# EAGLE design rev_beta_03_1H_smd_ab4 (EAGLE 7.3.0)

## Sheet 1 of 2
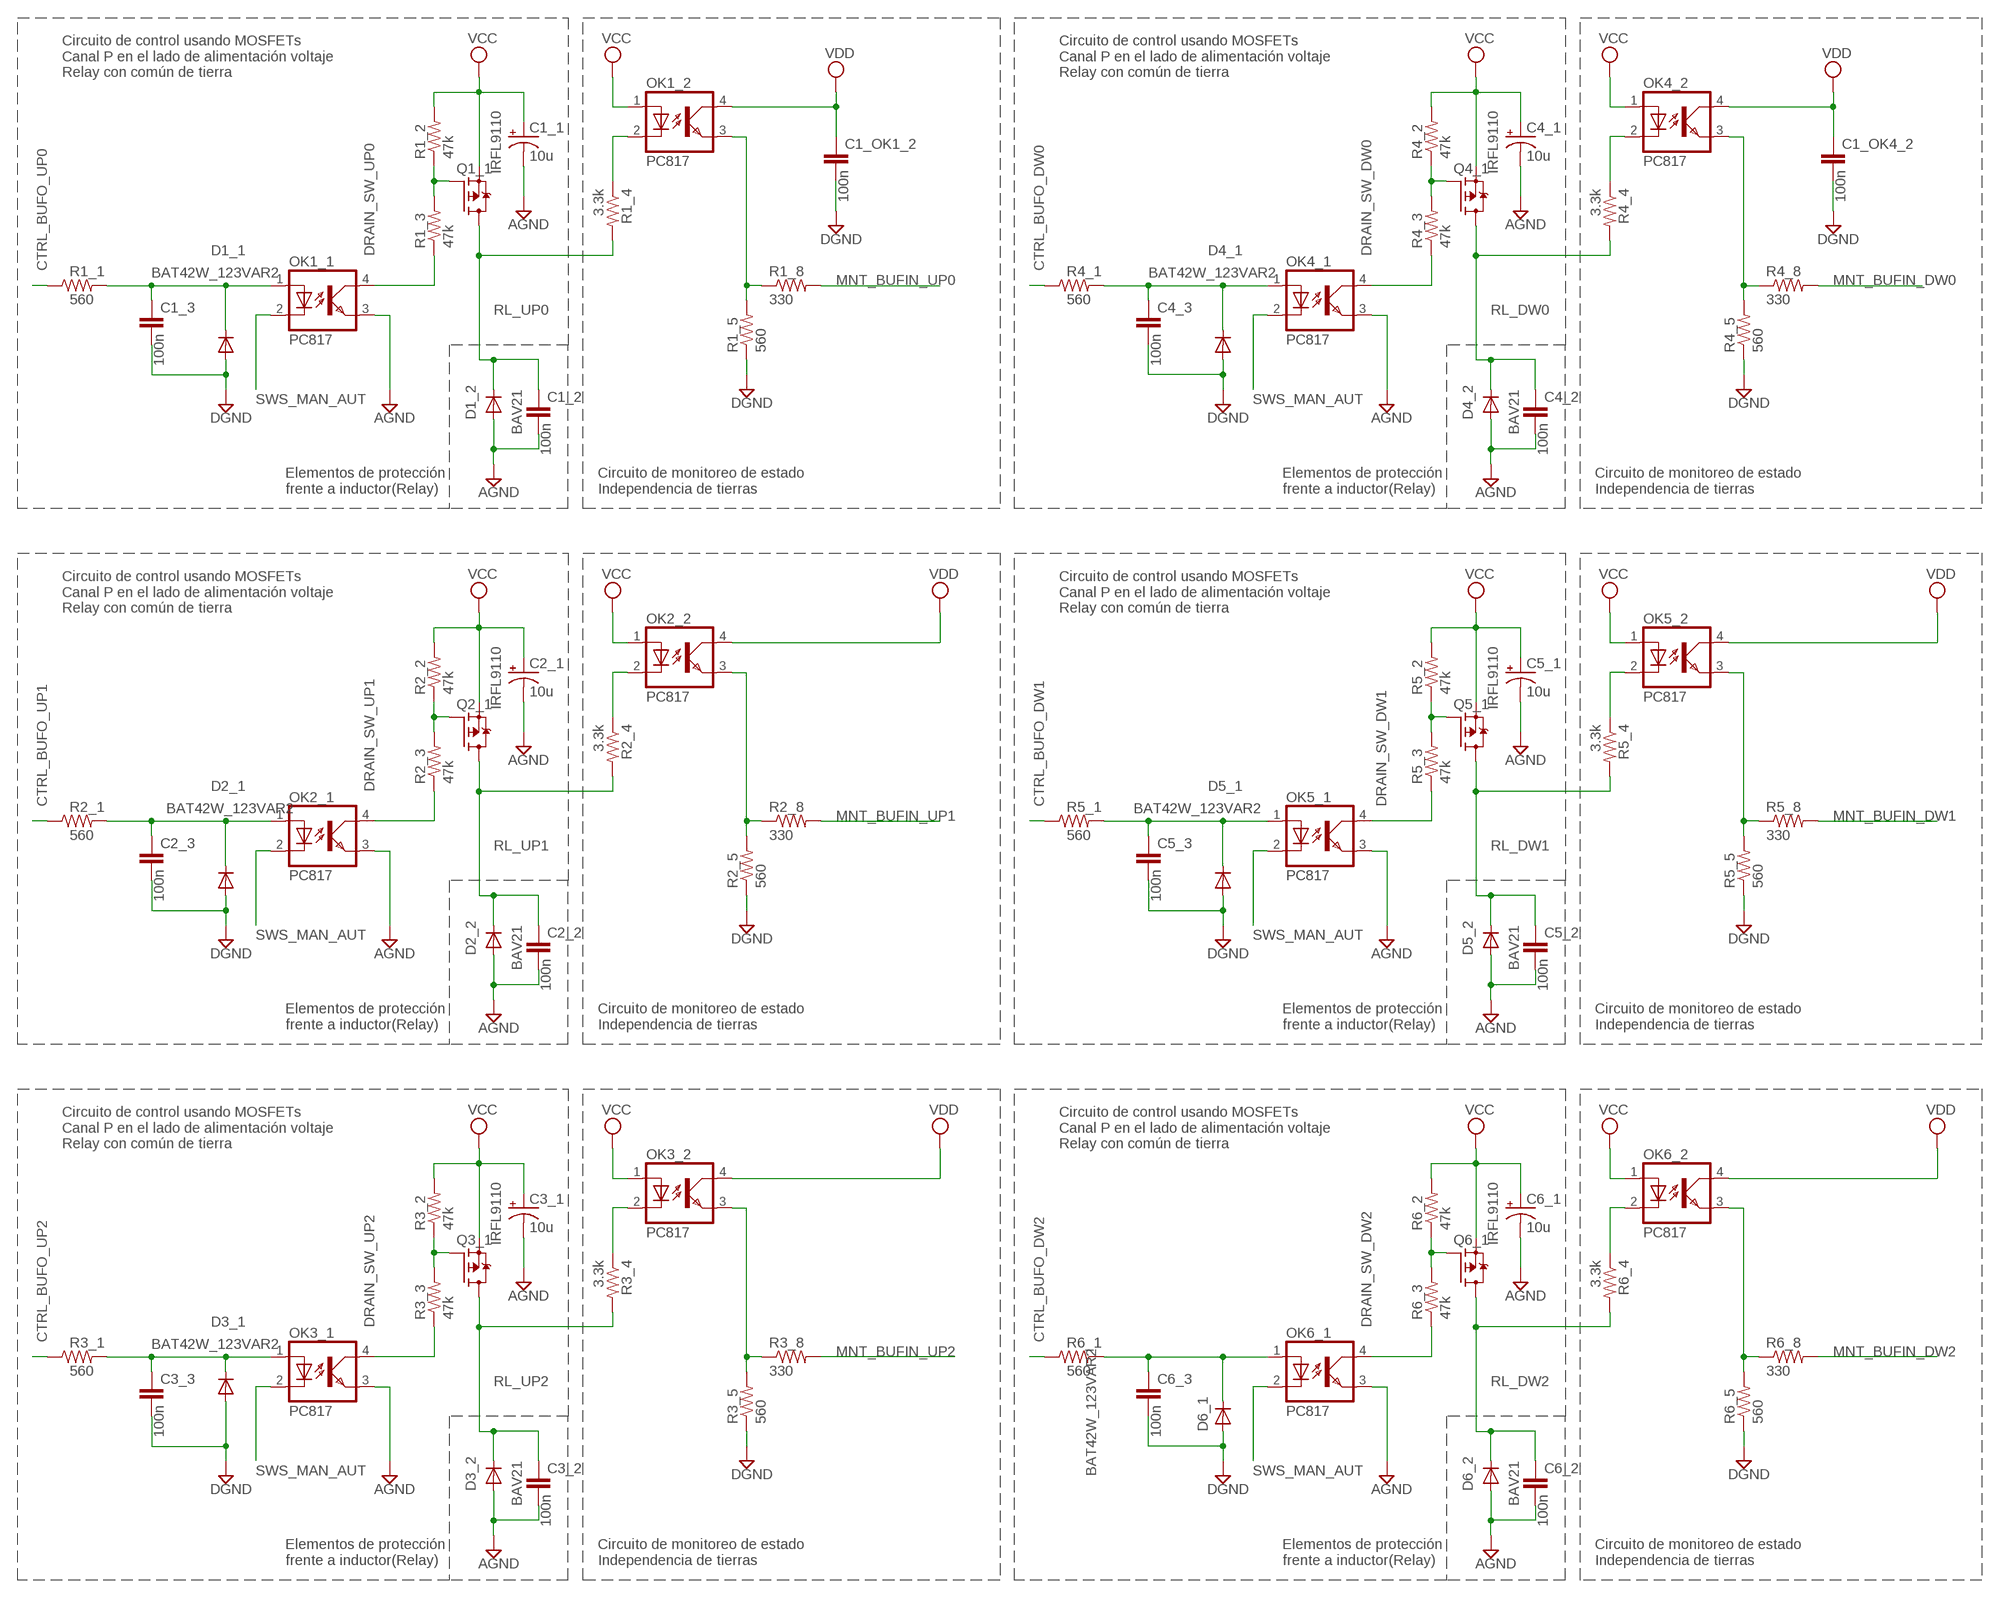
[diagram p0: schematic, sheet 1]

### Parts
C1_1  10u  CPOL-US153CLV-0605  [153CLV-0605]
C1_2  100n  C-EUC1206  [C1206]
C1_3  100n  C-EUC1206  [C1206]
C1_OK1_2  100n  C-EUC1206  [C1206]
C1_OK4_2  100n  C-EUC1206  [C1206]
C2_1  10u  CPOL-US153CLV-0605  [153CLV-0605]
C2_2  100n  C-EUC1206  [C1206]
C2_3  100n  C-EUC1206  [C1206]
C3_1  10u  CPOL-US153CLV-0605  [153CLV-0605]
C3_2  100n  C-EUC1206  [C1206]
C3_3  100n  C-EUC1206  [C1206]
C4_1  10u  CPOL-US153CLV-0605  [153CLV-0605]
C4_2  100n  C-EUC1206  [C1206]
C4_3  100n  C-EUC1206  [C1206]
C5_1  10u  CPOL-US153CLV-0605  [153CLV-0605]
C5_2  100n  C-EUC1206  [C1206]
C5_3  100n  C-EUC1206  [C1206]
C6_1  10u  CPOL-US153CLV-0605  [153CLV-0605]
C6_2  100n  C-EUC1206  [C1206]
C6_3  100n  C-EUC1206  [C1206]
D1_1  BAT42W_123VAR2  [SOD-523F]
D1_2  BAV21  [DO-35]
D2_1  BAT42W_123VAR2  [SOD-523F]
D2_2  BAV21  [DO-35]
D3_1  BAT42W_123VAR2  [SOD-523F]
D3_2  BAV21  [DO-35]
D4_1  BAT42W_123VAR2  [SOD-523F]
D4_2  BAV21  [DO-35]
D5_1  BAT42W_123VAR2  [SOD-523F]
D5_2  BAV21  [DO-35]
D6_1  BAT42W_123VAR2  [SOD-523F]
D6_2  BAV21  [DO-35]
OK1_1  PC817  [DIL04]
OK1_2  PC817  [DIL04]
OK2_1  PC817  [DIL04]
OK2_2  PC817  [DIL04]
OK3_1  PC817  [DIL04]
OK3_2  PC817  [DIL04]
OK4_1  PC817  [DIL04]
OK4_2  PC817  [DIL04]
OK5_1  PC817  [DIL04]
OK5_2  PC817  [DIL04]
OK6_1  PC817  [DIL04]
OK6_2  PC817  [DIL04]
Q1_1  IRFL9110  [SOT-223]
Q2_1  IRFL9110  [SOT-223]
Q3_1  IRFL9110  [SOT-223]
Q4_1  IRFL9110  [SOT-223]
Q5_1  IRFL9110  [SOT-223]
Q6_1  IRFL9110  [SOT-223]
R1_1  560  R-US_R1206  [R1206]
R1_2  47k  R-US_0207/10  [0207/10]
R1_3  47k  R-US_R1206  [R1206]
R1_4  3.3k  R-US_R1206  [R1206]
R1_5  560  R-US_R1206  [R1206]
R1_8  330  R-US_R1206  [R1206]
R2_1  560  R-US_R1206  [R1206]
R2_2  47k  R-US_0207/10  [0207/10]
R2_3  47k  R-US_R1206  [R1206]
R2_4  3.3k  R-US_R1206  [R1206]
R2_5  560  R-US_R1206  [R1206]
R2_8  330  R-US_R1206  [R1206]
R3_1  560  R-US_R1206  [R1206]
R3_2  47k  R-US_0207/10  [0207/10]
R3_3  47k  R-US_R1206  [R1206]
R3_4  3.3k  R-US_R1206  [R1206]
R3_5  560  R-US_R1206  [R1206]
R3_8  330  R-US_R1206  [R1206]
R4_1  560  R-US_R1206  [R1206]
R4_2  47k  R-US_0207/10  [0207/10]
R4_3  47k  R-US_R1206  [R1206]
R4_4  3.3k  R-US_R1206  [R1206]
R4_5  560  R-US_R1206  [R1206]
R4_8  330  R-US_R1206  [R1206]
R5_1  560  R-US_R1206  [R1206]
R5_2  47k  R-US_0207/10  [0207/10]
R5_3  47k  R-US_R1206  [R1206]
R5_4  3.3k  R-US_R1206  [R1206]
R5_5  560  R-US_R1206  [R1206]
R5_8  330  R-US_R1206  [R1206]
R6_1  560  R-US_R1206  [R1206]
R6_2  47k  R-US_0207/10  [0207/10]
R6_3  47k  R-US_R1206  [R1206]
R6_4  3.3k  R-US_R1206  [R1206]
R6_5  560  R-US_R1206  [R1206]
R6_8  330  R-US_R1206  [R1206]

### Nets
AGND: C1_1.- C1_2.2 C2_1.- C2_2.2 C3_1.- C3_2.2 C4_1.- C4_2.2 C5_1.- C5_2.2 C6_1.- C6_2.2 D1_2.A D2_2.A D3_2.A D4_2.A D5_2.A D6_2.A OK1_1.3(EMIT) OK2_1.3(EMIT) OK3_1.3(EMIT) OK4_1.3(EMIT) OK5_1.3(EMIT) OK6_1.3(EMIT) ; also sheet 2
CTRL_BUFO_DW0: R4_1.1 ; also sheet 2
CTRL_BUFO_DW1: R5_1.1 ; also sheet 2
CTRL_BUFO_DW2: R6_1.1 ; also sheet 2
CTRL_BUFO_UP0: R1_1.1 ; also sheet 2
CTRL_BUFO_UP1: R2_1.1 ; also sheet 2
CTRL_BUFO_UP2: R3_1.1 ; also sheet 2
DGND: C1_3.2 C1_OK1_2.2 C1_OK4_2.2 C2_3.2 C3_3.2 C4_3.2 C5_3.2 C6_3.2 D1_1.A D2_1.A D3_1.A D4_1.A D5_1.A D6_1.A R1_5.1 R2_5.1 R3_5.1 R4_5.1 R5_5.1 R6_5.1 ; also sheet 2
DRAIN_SW_DW0: OK4_1.4(COL) R4_3.1 ; also sheet 2
DRAIN_SW_DW1: OK5_1.4(COL) R5_3.1 ; also sheet 2
DRAIN_SW_DW2: OK6_1.4(COL) R6_3.1 ; also sheet 2
DRAIN_SW_UP0: OK1_1.4(COL) R1_3.1 ; also sheet 2
DRAIN_SW_UP1: OK2_1.4(COL) R2_3.1 ; also sheet 2
DRAIN_SW_UP2: OK3_1.4(COL) R3_3.1 ; also sheet 2
GATE-M/A-UP0: C1_3.1 D1_1.C OK1_1.1(A) R1_1.2
GATE-M/A-UP1: C2_3.1 D2_1.C OK2_1.1(A) R2_1.2
GATE-M/A-UP2: C3_3.1 D3_1.C OK3_1.1(A) R3_1.2
GATE-M/A-UP3: C4_3.1 D4_1.C OK4_1.1(A) R4_1.2
GATE-M/A-UP4: C5_3.1 D5_1.C OK5_1.1(A) R5_1.2
GATE-M/A-UP5: C6_3.1 D6_1.C OK6_1.1(A) R6_1.2
MNT_BUFIN_DW0: R4_8.2 ; also sheet 2
MNT_BUFIN_DW1: R5_8.2 ; also sheet 2
MNT_BUFIN_DW2: R6_8.2 ; also sheet 2
MNT_BUFIN_UP0: R1_8.2 ; also sheet 2
MNT_BUFIN_UP1: R2_8.2 ; also sheet 2
MNT_BUFIN_UP2: R3_8.2 ; also sheet 2
N$1: Q2_1.1(G) R2_2.1 R2_3.2
N$2: OK2_2.3(EMIT) R2_5.2 R2_8.1
N$4: OK1_2.2(C) R1_4.1
N$5: Q1_1.1(G) R1_2.1 R1_3.2
N$6: OK2_2.2(C) R2_4.1
N$8: OK1_2.3(EMIT) R1_5.2 R1_8.1
N$11: Q3_1.1(G) R3_2.1 R3_3.2
N$12: OK3_2.3(EMIT) R3_5.2 R3_8.1
N$13: OK3_2.2(C) R3_4.1
N$16: Q4_1.1(G) R4_2.1 R4_3.2
N$17: OK4_2.3(EMIT) R4_5.2 R4_8.1
N$18: OK4_2.2(C) R4_4.1
N$21: Q5_1.1(G) R5_2.1 R5_3.2
N$22: OK5_2.3(EMIT) R5_5.2 R5_8.1
N$23: OK5_2.2(C) R5_4.1
N$26: Q6_1.1(G) R6_2.1 R6_3.2
N$27: OK6_2.3(EMIT) R6_5.2 R6_8.1
N$28: OK6_2.2(C) R6_4.1
RL_DW0: C4_2.1 D4_2.C Q4_1.2(D) Q4_1.4(D) R4_4.2 ; also sheet 2
RL_DW1: C5_2.1 D5_2.C Q5_1.2(D) Q5_1.4(D) R5_4.2 ; also sheet 2
RL_DW2: C6_2.1 D6_2.C Q6_1.2(D) Q6_1.4(D) R6_4.2 ; also sheet 2
RL_UP0: C1_2.1 D1_2.C Q1_1.2(D) Q1_1.4(D) R1_4.2 ; also sheet 2
RL_UP1: C2_2.1 D2_2.C Q2_1.2(D) Q2_1.4(D) R2_4.2 ; also sheet 2
RL_UP2: C3_2.1 D3_2.C Q3_1.2(D) Q3_1.4(D) R3_4.2 ; also sheet 2
SWS_MAN_AUT: OK1_1.2(C) OK2_1.2(C) OK3_1.2(C) OK4_1.2(C) OK5_1.2(C) OK6_1.2(C) ; also sheet 2
VCC: C1_1.+ C2_1.+ C3_1.+ C4_1.+ C5_1.+ C6_1.+ OK1_2.1(A) OK2_2.1(A) OK3_2.1(A) OK4_2.1(A) OK5_2.1(A) OK6_2.1(A) Q1_1.3(S) Q2_1.3(S) Q3_1.3(S) Q4_1.3(S) Q5_1.3(S) Q6_1.3(S) R1_2.2 R2_2.2 R3_2.2 R4_2.2 R5_2.2 R6_2.2 ; also sheet 2
VDD: C1_OK1_2.1 C1_OK4_2.1 OK1_2.4(COL) OK2_2.4(COL) OK3_2.4(COL) OK4_2.4(COL) OK5_2.4(COL) OK6_2.4(COL) ; also sheet 2

### Notes on the sheet
- Circuito de control usando MOSFETs
  Canal P en el lado de alimentación voltaje
  Relay con común de tierra
- Circuito de control usando MOSFETs
  Canal P en el lado de alimentación voltaje
  Relay con común de tierra
- Elementos de protección
  frente a inductor(Relay)
- Circuito de monitoreo de estado
  Independencia de tierras
- Elementos de protección
  frente a inductor(Relay)
- Circuito de monitoreo de estado
  Independencia de tierras
- Circuito de control usando MOSFETs
  Canal P en el lado de alimentación voltaje
  Relay con común de tierra
- Circuito de control usando MOSFETs
  Canal P en el lado de alimentación voltaje
  Relay con común de tierra
- Elementos de protección
  frente a inductor(Relay)
- Circuito de monitoreo de estado
  Independencia de tierras
- Elementos de protección
  frente a inductor(Relay)
- Circuito de monitoreo de estado
  Independencia de tierras
- Circuito de control usando MOSFETs
  Canal P en el lado de alimentación voltaje
  Relay con común de tierra
- Circuito de control usando MOSFETs
  Canal P en el lado de alimentación voltaje
  Relay con común de tierra
- Elementos de protección
  frente a inductor(Relay)
- Circuito de monitoreo de estado
  Independencia de tierras
- Elementos de protección
  frente a inductor(Relay)
- Circuito de monitoreo de estado
  Independencia de tierras

## Sheet 2 of 2
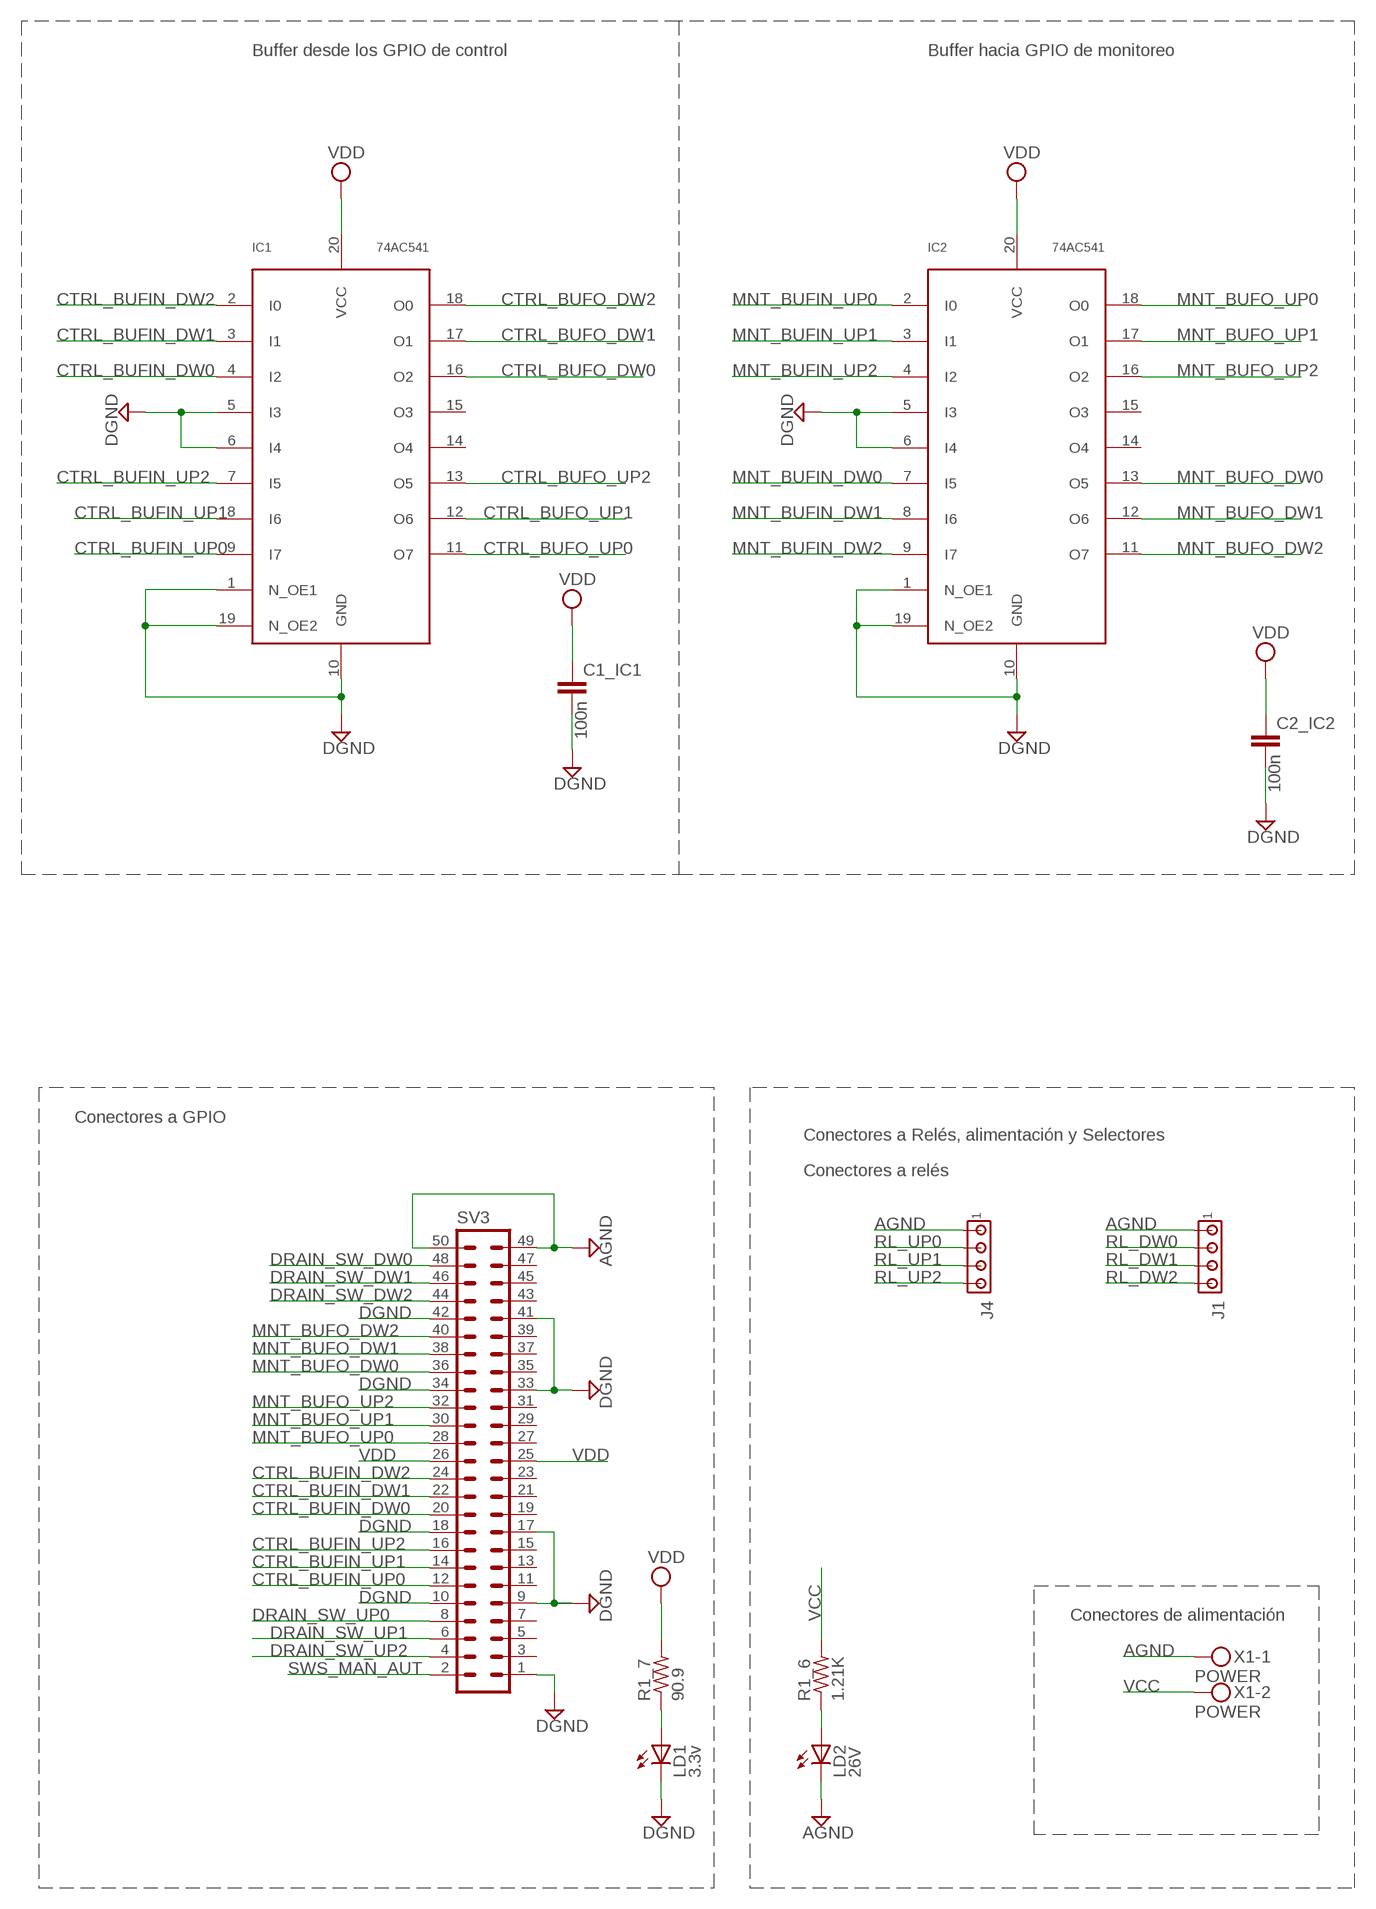
[diagram p1: schematic, sheet 2]

### Parts
C1_IC1  100n  C-EUC1206  [C1206]
C2_IC2  100n  C-EUC1206  [C1206]
IC1  74AC541  [SOIC-20DW]
IC2  74AC541  [SOIC-20DW]
J1  MTA04-156  [1X4MTA]
J4  MTA04-156  [1X4MTA]
LD1  3.3v  LEDCHIPLED_0603  [CHIPLED_0603]
LD2  26V  LEDCHIPLED_0603  [CHIPLED_0603]
R1_6  1.21K  R-US_R1206  [R1206]
R1_7  90.9  R-US_R1206  [R1206]
SV3  ML50"  [ML50]
X1  POWER  MKDSN1,5/2-5,08  [MKDSN1,5/2-5,08]

### Nets
AGND: J1.1 J4.1 LD2.C SV3.49 SV3.50 X1.1 ; also sheet 1
CTRL_BUFIN_DW0: IC1.4(I2) SV3.20
CTRL_BUFIN_DW1: IC1.3(I1) SV3.22
CTRL_BUFIN_DW2: IC1.2(I0) SV3.24
CTRL_BUFIN_UP0: IC1.9(I7) SV3.12
CTRL_BUFIN_UP1: IC1.8(I6) SV3.14
CTRL_BUFIN_UP2: IC1.7(I5) SV3.16
CTRL_BUFO_DW0: IC1.16(O2) ; also sheet 1
CTRL_BUFO_DW1: IC1.17(O1) ; also sheet 1
CTRL_BUFO_DW2: IC1.18(O0) ; also sheet 1
CTRL_BUFO_UP0: IC1.11(O7) ; also sheet 1
CTRL_BUFO_UP1: IC1.12(O6) ; also sheet 1
CTRL_BUFO_UP2: IC1.13(O5) ; also sheet 1
DGND: C1_IC1.2 C2_IC2.2 IC1.1(N_OE1) IC1.5(I3) IC1.6(I4) IC1.10(GND) IC1.19(N_OE2) IC2.1(N_OE1) IC2.5(I3) IC2.6(I4) IC2.10(GND) IC2.19(N_OE2) LD1.C SV3.1 SV3.9 SV3.10 SV3.17 SV3.18 SV3.33 SV3.34 SV3.41 SV3.42 ; also sheet 1
DRAIN_SW_DW0: SV3.48 ; also sheet 1
DRAIN_SW_DW1: SV3.46 ; also sheet 1
DRAIN_SW_DW2: SV3.44 ; also sheet 1
DRAIN_SW_UP0: SV3.8 ; also sheet 1
DRAIN_SW_UP1: SV3.6 ; also sheet 1
DRAIN_SW_UP2: SV3.4 ; also sheet 1
MNT_BUFIN_DW0: IC2.7(I5) ; also sheet 1
MNT_BUFIN_DW1: IC2.8(I6) ; also sheet 1
MNT_BUFIN_DW2: IC2.9(I7) ; also sheet 1
MNT_BUFIN_UP0: IC2.2(I0) ; also sheet 1
MNT_BUFIN_UP1: IC2.3(I1) ; also sheet 1
MNT_BUFIN_UP2: IC2.4(I2) ; also sheet 1
MNT_BUFO_DW0: IC2.13(O5) SV3.36
MNT_BUFO_DW1: IC2.12(O6) SV3.38
MNT_BUFO_DW2: IC2.11(O7) SV3.40
MNT_BUFO_UP0: IC2.18(O0) SV3.28
MNT_BUFO_UP1: IC2.17(O1) SV3.30
MNT_BUFO_UP2: IC2.16(O2) SV3.32
N$9: LD2.A R1_6.1
N$10: LD1.A R1_7.1
RL_DW0: J1.2 ; also sheet 1
RL_DW1: J1.3 ; also sheet 1
RL_DW2: J1.4 ; also sheet 1
RL_UP0: J4.2 ; also sheet 1
RL_UP1: J4.3 ; also sheet 1
RL_UP2: J4.4 ; also sheet 1
SWS_MAN_AUT: SV3.2 ; also sheet 1
VCC: R1_6.2 X1.2 ; also sheet 1
VDD: C1_IC1.1 C2_IC2.1 IC1.20(VCC) IC2.20(VCC) R1_7.2 SV3.25 SV3.26 ; also sheet 1
Unconnected: IC1.14(O4) IC1.15(O3) IC2.14(O4) IC2.15(O3) SV3.3 SV3.5 SV3.7 SV3.11 SV3.13 SV3.15 SV3.19 SV3.21 SV3.23 SV3.27 SV3.29 SV3.31 SV3.35 SV3.37 SV3.39 SV3.43 SV3.45 SV3.47

### Notes on the sheet
- Buffer desde los GPIO de control | Buffer hacia GPIO de monitoreo
- Conectores a GPIO
- Conectores a Relés, alimentación y Selectores
- Conectores a relés
- Conectores de alimentación

## Library data of the parts
C1_1 C2_1 C3_1 C4_1 C5_1 C6_1 = rcl:CPOL-US: POLARIZED CAPACITOR, American symbol
C1_2 C1_3 C1_IC1 C1_OK1_2 C1_OK4_2 C2_2 C2_3 C2_IC2 C3_2 C3_3 C4_2 C4_3 C5_2 C5_3 C6_2 C6_3 = rcl:C-EU: CAPACITOR, European symbol
D1_1 D2_1 D3_1 D4_1 D5_1 D6_1 = BAT42W_123:BAT42W_123: BAT42W in package SOD-123
D1_2 D2_2 D3_2 D4_2 D5_2 D6_2 = BAV21_ROJ:BAV21: Diode BAV21 ROJ Diodo disponible en el ROJ de 250V y 250mA; DIGIKEY_PN: BAV21_T50RCT-ND; MANUFACTURE: Fairchild Semiconductor; MPN: BAV21_T50R
IC1 IC2 = 74AC541:74AC541: 74AC541 Octal Buffer/Line Driver with 3-state Outputs; MANUFACTURE: Fairchild; MPN: 74AC541SC
J1 J4 = con-amp:MTA04-156: AMP connector
LD1 LD2 = led:LED: LED OSRAM: - CHIPLED LG R971, LG N971, LY N971, LG Q971, LY Q971, LO R971, LY R971 LH N974, LH R974 LS Q976, LO Q976, LY Q976 LO Q996 - Hyper CHIPLED LW Q18S LB Q993, LB Q99A, LB R99A - SideLED LS A670, LO A670, LY A670, LG A670, LP A670 LB A673, LV A673, LT A673, LW A673 LH A674 LY A675 LS A676, LA A676, LO A676, LY A676, LW A676 LS A679, LY A679, LG A679 - Hyper Micro SIDELED® LS Y876, LA Y876, LO Y876, LY Y876 LT Y87S - SmartLED LW L88C, LW L88S LB L89C, LB L89S, LG L890 LS L89K, LO L89K, LY L89K LS L896, LA L896, LO L896, LY L896 - TOPLED LS T670, LO T670, LY T670, LG T670, LP T670 LSG T670, LSP T670, LSY T670, LOP T670, LYG T670 LG T671, LOG T671, LSG T671 LB T673, LV T673, LT T673, LW T673 LH T674 LS T676, LA T676, LO T676, LY T676, LB T676, LH T676, LSB T676, LW T676 LB T67C, LV T67C, LT T67C, LS T67K, LO T67K, LY T67K, LW E67C LS E67B, LA E67B, LO E67B, LY E67B, LB E67C, LV E67C, LT E67C LW T67C LS T679, LY T679, LG T679 LS T770, LO T770, LY T770, LG T770, LP T770 LB T773, LV T773, LT T773, LW T773 LH T774 LS E675, LA E675, LY E675, LS T675 LS T776, LA T776, LO T776, LY T776, LB T776 LHGB T686 LT T68C, LB T68C - Hyper Mini TOPLED® LB M676 - Mini TOPLED Santana® LG M470 LS M47K, LO M47K, LY M47K Source: http://www.osram.convergy.de LUXEON: - LUMILED® LXK2-PW12-R00, LXK2-PW12-S00, LXK2-PW14-U00, LXK2-PW14-V00 LXK2-PM12-R00, LXK2-PM12-S00, LXK2-PM14-U00 LXK2-PE12-Q00, LXK2-PE12-R00, LXK2-PE12-S00, LXK2-PE14-T00, LXK2-PE14-U00 LXK2-PB12-K00, LXK2-PB12-L00, LXK2-PB12-M00, LXK2-PB14-N00, LXK2-PB14-P00, LXK2-PB14-Q00 LXK2-PR12-L00, LXK2-PR12-M00, LXK2-PR14-Q00, LXK2-PR14-R00 LXK2-PD12-Q00, LXK2-PD12-R00, LXK2-PD12-S00 LXK2-PH12-R00, LXK2-PH12-S00 LXK2-PL12-P00, LXK2-PL12-Q00, LXK2-PL12-R00 Source: www.luxeon.com KINGBRIGHT: KA-3528ASYC Source: www.kingbright.com
OK1_1 OK1_2 OK2_1 OK2_2 OK3_1 OK3_2 OK4_1 OK4_2 OK5_1 OK5_2 OK6_1 OK6_2 = optocoupler:PC817: SHARP OPTO COUPLER; MPN: PC817X4J000F; OC_FARNELL: 9707727; OC_NEWARK: 97K7059
Q1_1 Q2_1 Q3_1 Q4_1 Q5_1 Q6_1 = IRFL9110:IRFL9110: MOSFET Transistor P-Channel depletion mosfet transistor 100V 1.1A; DIGIKEY_PN: IRFL9110PBFCT-ND; MANUFACTURE: Vishay; MPN: IRFL9110TRPBF
R1_1-R1_8 R2_1-R2_5 R2_8 R3_1-R3_5 R3_8 R4_1-R4_5 R4_8 R5_1-R5_5 R5_8 R6_1-R6_5 R6_8 = rcl:R-US_: RESISTOR, American symbol
SV3 = con-harting-ml:ML50: HARTING; OC_FARNELL: unknown; OC_NEWARK: unknown
X1 = con-phoenix-508:MKDSN1,5/2-5,08: MKDSN 1,5/ 2-5,08 Printklemme Nennstrom: 13,5 A Nennspannung: 250 V Rastermaß: 5,08 mm Polzahl: 2 Anschlussart: Schraubanschluss Montage: Löten Anschlussrichtung Leiter/Platine: 0 ° Artikelnummer: 1729128 Source: http://eshop.phoenixcontact.com .. 1729128.pdf

## Board
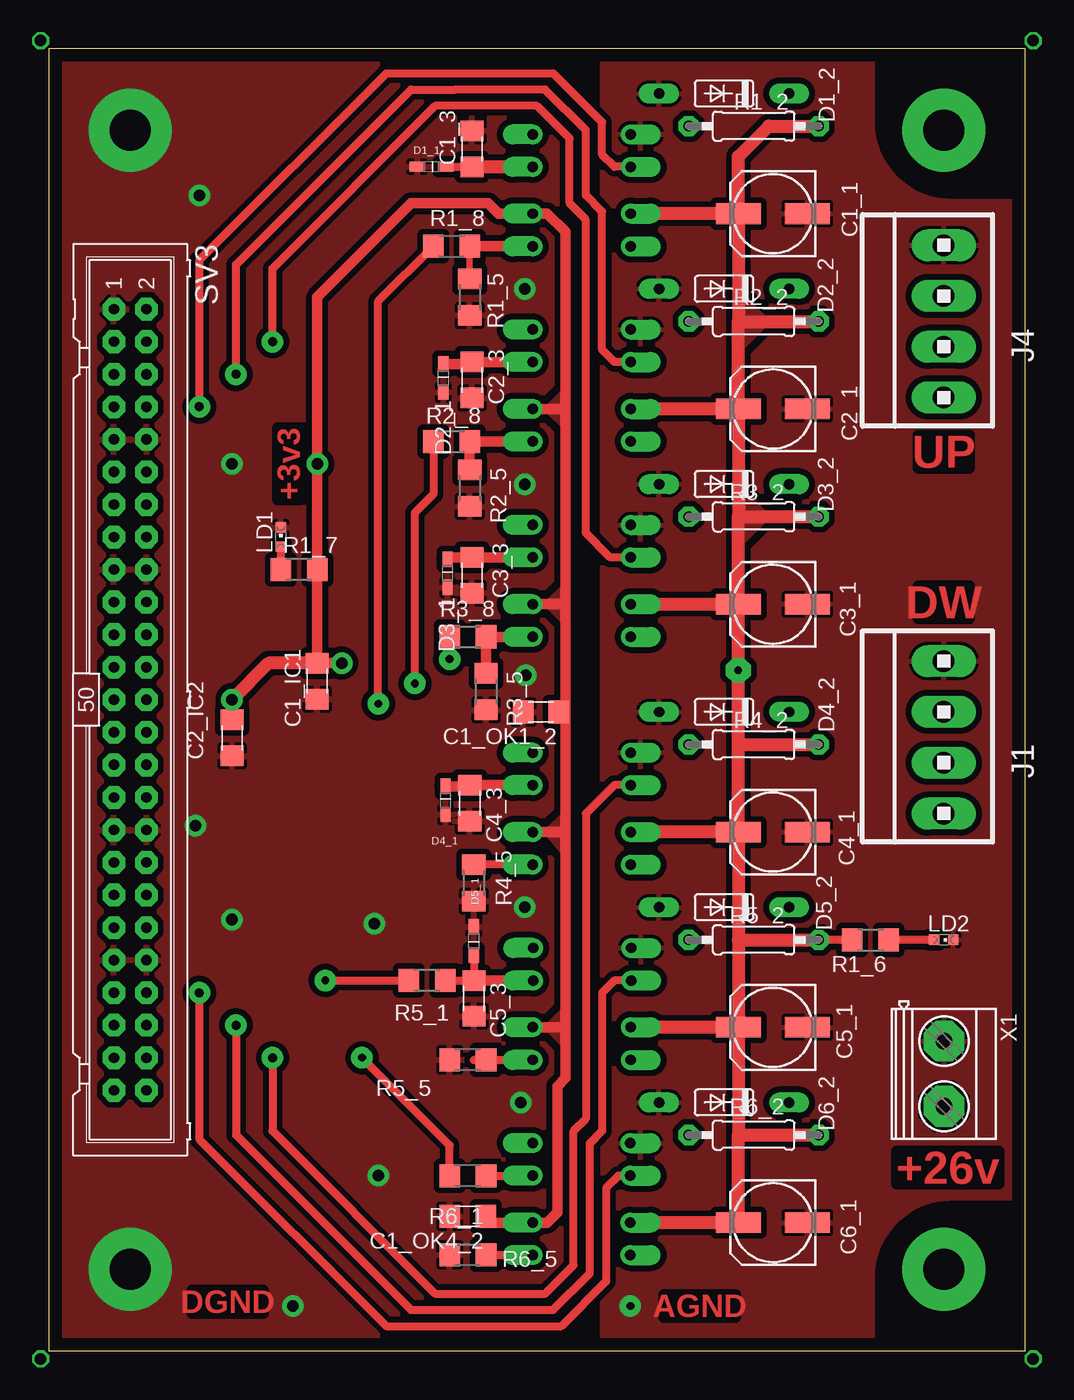
[diagram p2: board, top side]
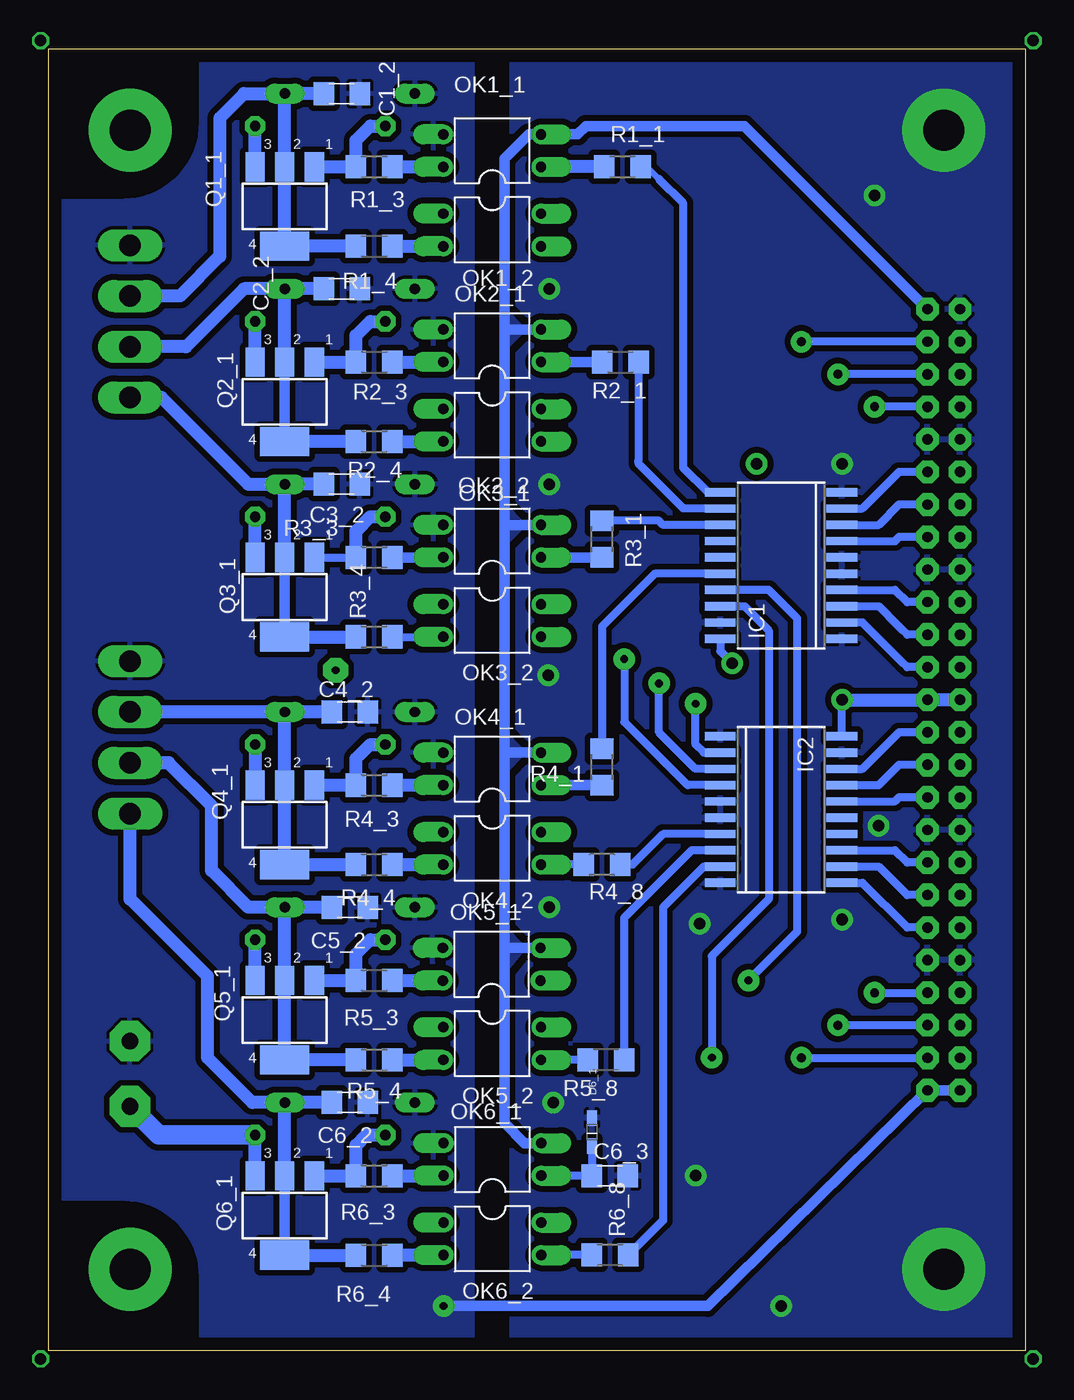
[diagram p3: board, bottom side, seen from below]

Size 76.2 x 101.6 mm. Coordinates in mm from the lower left corner, seen from the top.
Outline: 0,101.6 0,0 76.2,0 76.2,101.6 0,101.6
Copper layers (1*16): Top 0.035mm / dielectric 1.5mm / Bottom 0.035mm
Design rules "default *": minimum track width 10mil, minimum drill 24mil, track to track 12mil, track to pad 12mil, pad to pad 12mil, via to via 12mil, smd to smd 12mil, copper to edge 40mil, drill to drill 8mil, minimum pad ring 15mil, minimum via ring 8mil, stop-mask expansion 4mil, vias tented up to drill 0mil, thermal gap 10mil
tRestrict: area 65.1,90.5 to 74.9,100.3; area 65.1,1.3 to 74.9,11.1
bRestrict: area 65.1,90.5 to 74.9,100.3; area 65.1,1.3 to 74.9,11.1

### Footprints (pad centres in the part's own frame; a part is rotated, then mirrored left to right if it is on the bottom)
153CLV-0605 = smd 3.5 x 1.6: + 2.7,0; - -2.7,0
C1206 = smd 1.6 x 1.8: 1 -1.4,0; 2 1.4,0
SOD-523F = smd 1.2 x 0.8: A 1.1,0; C -1.1,0
DO-35 = drill 0.813 long: A 5.08,0; C -5.08,0
SOIC-20DW = smd 0.65 x 2.4: 1 -5.715,-4.75; 2 -4.445,-4.75; 3 -3.175,-4.75; 4 -1.905,-4.75; 5 -0.635,-4.75; 6 0.635,-4.75; 7 1.905,-4.75; 8 3.175,-4.75; 9 4.445,-4.75; 10 5.715,-4.75; 11 5.715,4.75; 12 4.445,4.75; 13 3.175,4.75; 14 1.905,4.75; 15 0.635,4.75; 16 -0.635,4.75; 17 -1.905,4.75; 18 -3.175,4.75; 19 -4.445,4.75; 20 -5.715,4.75
1X4MTA = drill 1.676 long: 1 5.944,0; 2 1.981,0; 3 -1.981,0; 4 -5.944,0
CHIPLED_0603 = smd 0.8 x 0.8: A 0,-0.75; C 0,0.75
DIL04 = drill 0.813 offset: 1 -1.27,-3.81; 2 1.27,-3.81; 3 1.27,3.81; 4 -1.27,3.81
SOT-223 = smd 1.5 x 2.286: 1 -2.311,-3.099; 2 0,-3.099; 3 2.311,-3.099 | smd 3.81 x 2.286: 4 0,3.099
R1206 = smd 1.6 x 1.803: 1 -1.422,0; 2 1.422,0
0207/10 = drill 0.813 octagon: 1 -5.08,0; 2 5.08,0
ML50 = drill 0.8 pad 1.778 octagon: 1 -30.48,-1.27; 2 -30.48,1.27; 3 -27.94,-1.27; 4 -27.94,1.27; 5 -25.4,-1.27; 6 -25.4,1.27; 7 -22.86,-1.27; 8 -22.86,1.27; 9 -20.32,-1.27; 10 -20.32,1.27; 11 -17.78,-1.27; 12 -17.78,1.27; 13 -15.24,-1.27; 14 -15.24,1.27; 15 -12.7,-1.27; 16 -12.7,1.27; 17 -10.16,-1.27; 18 -10.16,1.27; 19 -7.62,-1.27; 20 -7.62,1.27; 21 -5.08,-1.27; 22 -5.08,1.27; 23 -2.54,-1.27; 24 -2.54,1.27; 25 0,-1.27; 26 0,1.27; 27 2.54,-1.27; 28 2.54,1.27; 29 5.08,-1.27; 30 5.08,1.27; 31 7.62,-1.27; 32 7.62,1.27; 33 10.16,-1.27; 34 10.16,1.27; 35 12.7,-1.27; 36 12.7,1.27; 37 15.24,-1.27; 38 15.24,1.27; 39 17.78,-1.27; 40 17.78,1.27; 41 20.32,-1.27; 42 20.32,1.27; 43 22.86,-1.27; 44 22.86,1.27; 45 25.4,-1.27; 46 25.4,1.27; 47 27.94,-1.27; 48 27.94,1.27; 49 30.48,-1.27; 50 30.48,1.27
MKDSN1,5/2-5,08 = drill 1.3 pad 3.175 octagon: 1 -2.561,0.025; 2 2.519,0.025

### Placement (x,y rotation side)
C1_1  56.52,88.73 180 top
C1_2  53.34,98.11 0 bottom
C1_3  33.02,93.79 90 top
C1_IC1  20.94,52.26 270 top
C1_OK1_2  38.42,49.85 180 top
C1_OK4_2  32.7,10.48 180 top
C2_1  56.52,73.49 180 top
C2_2  53.34,82.87 0 bottom
C2_3  33.02,75.75 270 top
C2_IC2  14.3,47.83 270 top
C3_1  56.52,58.25 180 top
C3_2  53.34,67.63 0 bottom
C3_3  33.02,60.51 270 top
C4_1  56.52,40.47 180 top
C4_2  52.7,49.85 0 bottom
C4_3  32.85,42.73 270 top
C5_1  56.52,25.23 180 top
C5_2  52.7,34.61 0 bottom
C5_3  33.17,27.49 270 top
C6_1  56.52,9.99 180 top
C6_2  52.7,19.37 0 bottom
C6_3  32.41,13.65 0 bottom
D1_1  29.87,92.39 180 top
D1_2  52.7,98.11 180 top
D2_1  30.8,75.91 270 top
D2_2  52.7,82.87 180 top
D3_1  31.11,60.67 270 top
D3_2  52.7,67.63 180 top
D4_1  30.96,42.95 270 top
D4_2  52.7,49.85 180 top
D5_1  33.17,31.98 90 top
D5_2  52.7,34.61 180 top
D6_1  33.81,17.06 90 bottom
D6_2  52.7,19.37 180 top
IC1  19.05,61.28 90 bottom
IC2  19.05,42.23 270 bottom
J1  69.85,47.87 90 top
J4  69.85,80.33 90 top
LD1  18.11,63.5 0 top
LD2  69.85,32.07 270 top
OK1_1  41.59,93.66 90 bottom
OK1_2  41.59,87.46 270 bottom
OK2_1  41.59,78.42 90 bottom
OK2_2  41.59,72.22 270 bottom
OK3_1  41.59,63.18 90 bottom
OK3_2  41.59,56.98 270 bottom
OK4_1  41.59,45.4 90 bottom
OK4_2  41.59,39.2 270 bottom
OK5_1  41.64,30.16 90 bottom
OK5_2  41.59,23.96 270 bottom
OK6_1  41.58,14.92 90 bottom
OK6_2  41.58,8.72 270 bottom
Q1_1  57.78,89.29 180 bottom
Q2_1  57.78,74.05 180 bottom
Q3_1  57.78,58.81 180 bottom
Q4_1  57.78,41.03 180 bottom
Q5_1  57.78,25.79 180 bottom
Q6_1  57.78,10.55 180 bottom
R1_1  31.43,92.39 180 bottom
R1_2  55.02,95.57 0 top
R1_3  50.8,92.39 180 bottom
R1_4  50.8,86.19 180 bottom
R1_5  32.85,82.23 90 top
R1_6  64.14,32.07 180 top
R1_7  19.53,60.96 0 top
R1_8  31.43,86.19 180 top
R2_1  31.6,77.15 180 bottom
R2_2  55.02,80.33 0 top
R2_3  50.8,77.15 180 bottom
R2_4  50.8,70.95 180 bottom
R2_5  32.85,67.31 90 top
R2_8  31.43,70.95 180 top
R3_1  33.02,63.33 270 bottom
R3_2  55.02,65.09 0 top
R3_3  50.8,61.91 180 bottom
R3_4  50.8,55.71 180 bottom
R3_5  34.12,51.44 90 top
R3_8  32.7,55.71 180 top
R4_1  33.02,45.55 270 bottom
R4_2  55.02,47.31 0 top
R4_3  50.8,44.13 180 bottom
R4_4  50.8,37.93 180 bottom
R4_5  33.17,36.51 90 top
R4_8  33.02,37.93 0 bottom
R5_1  29.53,28.89 0 top
R5_2  55.02,32.07 0 top
R5_3  50.8,28.89 180 bottom
R5_4  50.8,22.69 180 bottom
R5_5  32.7,22.71 0 top
R5_8  32.7,22.71 0 bottom
R6_1  32.7,13.65 0 top
R6_2  55.02,16.83 0 top
R6_3  50.8,13.65 180 bottom
R6_4  50.8,7.45 180 bottom
R6_5  32.7,7.47 0 top
R6_8  32.38,7.47 0 bottom
SV3  6.35,50.8 270 top
X1  69.85,21.59 270 top

### Tracks (layer width: path | path; a pad name or v marks a point on that pad's centre or on a via)
AGND  (via drill 0.6 pad 1.68)
  Bottom 0.813: SV3.49 SV3.50 24.77,3.49 v45.39,3.49
  pour Bottom (isolate 0.457): 77.47,104.14 43.18,104.14 43.18,-2.54 77.47,-2.54
  pour Top (isolate 0.457, rank 2): 76.83,104.78 43.18,104.78 43.18,-1.91 76.83,-1.91
CTRL_BUFIN_DW0
  Bottom 0.61: IC1.4 10.16,59.37 9.21,58.42 SV3.20
CTRL_BUFIN_DW1
  Bottom 0.61: IC1.3 11.43,58.1 9.84,56.52 9.53,56.2 9.21,55.88 SV3.22
CTRL_BUFIN_DW2
  Bottom 0.61: IC1.2 12.7,56.83 9.84,53.98 9.53,53.66 9.21,53.34 SV3.24
CTRL_BUFIN_UP0
  Bottom 0.61: IC1.9 12.7,65.72 9.84,68.58 SV3.12
CTRL_BUFIN_UP1
  Bottom 0.61: IC1.8 11.43,64.45 9.84,66.04 SV3.14
CTRL_BUFIN_UP2
  Bottom 0.61: IC1.7 10.16,63.18 9.84,63.5 SV3.16
CTRL_BUFO_DW0
  Bottom 0.61: R4_1.1 33.02,56.52 28.89,60.64 IC1.16
CTRL_BUFO_DW1  (via drill 0.6 pad 1.68)
  Top 0.61: v21.59,28.89 R5_1.1
  Bottom 0.61: IC1.17 20,59.37 17.78,57.15 17.78,32.7 v21.59,28.89
CTRL_BUFO_DW2  (via drill 0.6 pad 1.68)
  Top 0.61: R6_1.1 31.28,16.03 v24.45,22.86
  Bottom 0.61: v24.45,22.86 24.45,30.8 20,35.24 20,56.2 21.91,58.1 IC1.18
CTRL_BUFO_UP0
  Bottom 0.508: 28.57,91.44 30.01,92.88 R1_1.1
  Bottom 0.61: 28.57,91.44 26.67,89.53 26.67,68.9 24.77,66.99 IC1.11
CTRL_BUFO_UP1
  Bottom 0.61: R2_1.1 30.18,69.85 30.18,69.55 30.18,69.23 26.67,65.72 IC1.12
CTRL_BUFO_UP2
  Bottom 0.61: R3_1.1 33.01,64.77 28.57,64.77 28.26,64.45 IC1.13
DGND  (via drill 0.9 pad 1.68, 3.2 pad 6.45)
  other vias: 37.15,82.87 37.21,52.7 37.15,67.63 25.4,33.34 14.29,69.22 37.15,34.61 14.29,33.66 6.35,95.25 6.35,6.35 36.83,19.37 11.75,90.17 25.72,13.65 11.43,40.96 19.05,3.49
  pour Top (isolate 0.457, rank 2): 40.01,104.14 -3.81,104.14 -3.81,-0.95 40.01,-0.64
  pour Bottom (isolate 0.457, rank 2): 40.01,104.78 -3.17,104.78 -3.17,-0.64 40.01,-0.64
DRAIN_SW_DW0  (via drill 0.7 pad 1.68)
  Top 0.61: OK4_1.4 44.13,44.13 41.91,41.91 41.91,18.1 40.96,17.14 40.96,6.67 38.73,4.45 30.16,4.45 17.46,17.14 v17.46,22.86
  Bottom 0.61: v17.46,22.86 SV3.48
  Bottom 1.016: R4_3.1 OK4_1.4
DRAIN_SW_DW1  (via drill 0.7 pad 1.68)
  Top 0.61: OK5_1.4 44.13,28.89 43.18,27.94 43.18,17.14 42.23,16.19 42.23,6.03 39.37,3.17 28.26,3.17 14.61,16.83 v14.61,25.4
  Bottom 0.61: SV3.46 v14.61,25.4
  Bottom 1.016: R5_3.1 OK5_1.4
DRAIN_SW_DW2  (via drill 0.7 pad 1.68)
  Top 0.61: OK6_1.4 44.45,13.65 43.5,12.7 43.5,5.4 40.01,1.91 26.35,1.91 11.75,16.51 v11.75,27.94
  Bottom 0.61: v11.75,27.94 SV3.44
  Bottom 1.016: R6_3.1 OK6_1.4
DRAIN_SW_UP0  (via drill 0.7 pad 1.68)
  Top 0.61: OK1_1.4 44.13,92.39 43.18,93.34 43.18,95.89 39.37,99.69 26.35,99.69 11.75,85.09 v11.75,73.66
  Bottom 0.61: SV3.8 v11.75,73.66
  Bottom 1.016: R1_3.1 OK1_1.4
DRAIN_SW_UP1  (via drill 0.7 pad 1.68)
  Top 0.508: 31.75,98.42 29.53,98.42
  Top 0.61: OK2_1.4 44.13,77.15 43.18,78.11 43.18,88.9 41.91,90.17 41.91,95.25 38.73,98.42 31.75,98.42 28.26,98.42 14.61,84.77 v14.61,76.2
  Bottom 0.61: SV3.6 v14.61,76.2
  Bottom 1.016: R2_3.1 OK2_1.4
DRAIN_SW_UP2  (via drill 0.7 pad 1.68)
  Top 0.61: OK3_1.4 43.81,61.91 41.91,63.82 41.91,88.27 40.64,89.53 40.64,94.61 38.1,97.16 30.16,97.16 17.46,84.45 v17.46,78.74
  Bottom 0.61: SV3.4 v17.46,78.74
  Bottom 0.813: OK3_1.4 R3_3.1
GATE-M/A-UP0
  Top 0.61: D1_1.C C1_3.1
  Top 1.016: C1_3.1 OK1_1.1
  Bottom 1.016: R1_1.2 OK1_1.1
GATE-M/A-UP1
  Top 0.813: OK2_1.1 C2_3.1 32.88,77.01 D2_1.C
  Bottom 0.813: C2_3.1 OK2_1.1
GATE-M/A-UP2
  Top 0.813: OK3_1.1 C3_3.1 31.26,61.91 D3_1.C
  Bottom 0.813: C3_3.1 OK3_1.1
GATE-M/A-UP3
  Top 0.813: OK4_1.1 C4_3.1 32.85,44.05 D4_1.C
  Bottom 0.813: R4_1.2 OK4_1.1
GATE-M/A-UP4
  Top 0.61: D5_1.C C5_3.1 R5_1.2
  Top 0.813: OK5_1.1 C5_3.1
GATE-M/A-UP5
  Top 0.61: R6_1.2 OK6_1.1
  Bottom 0.61: OK6_1.1 C6_3.1 D6_1.C
MNT_BUFIN_DW0
  Bottom 0.61: IC2.7 28.26,40.32 30.64,37.94 R4_8.2
MNT_BUFIN_DW1
  Bottom 0.61: R5_8.2 31.28,33.81 26.04,39.05 IC2.8
MNT_BUFIN_DW2
  Bottom 0.61: R6_8.2 28.26,10.17 28.26,34.61 25.08,37.78 IC2.9
MNT_BUFIN_UP0  (via drill 0.6 pad 1.68)
  Top 0.61: R1_8.2 30.01,86.21 25.72,81.92 v25.72,50.48
  Bottom 0.61: IC2.2 25.08,46.67 25.72,47.31 v25.72,50.48
MNT_BUFIN_UP1  (via drill 0.6 pad 1.68)
  Top 0.61: v28.57,52.07 28.57,65.41 30.01,66.84 R2_8.2
  Bottom 0.61: IC2.3 25.72,45.4 28.57,48.26 v28.57,52.07
MNT_BUFIN_UP2  (via drill 0.6 pad 1.68)
  Top 0.61: R3_8.2 v31.28,53.98
  Bottom 0.61: v31.28,53.98 31.28,49.06 26.35,44.13 IC2.4
MNT_BUFO_DW0
  Bottom 0.61: IC2.13 10.16,39.05 9.21,38.1 SV3.36
MNT_BUFO_DW1
  Bottom 0.61: IC2.12 11.43,37.78 9.21,35.56 SV3.38
MNT_BUFO_DW2
  Bottom 0.61: IC2.11 12.7,36.51 9.21,33.02 SV3.40
MNT_BUFO_UP0
  Bottom 0.61: IC2.18 12.7,45.4 9.84,48.26 SV3.28
MNT_BUFO_UP1
  Bottom 0.61: IC2.17 11.43,44.13 9.84,45.72 SV3.30
MNT_BUFO_UP2
  Bottom 0.61: IC2.16 10.16,42.86 9.84,43.18 SV3.32
N$1
  Bottom 1.016: Q2_1.1 R2_3.2 52.22,79.22 51.12,80.33 R2_2.1
N$2
  Top 0.813: OK2_2.3 R2_8.1 R2_5.2
N$3  (via drill 3.2 pad 6.45)
  other vias: 69.85,6.35
N$4
  Bottom 1.016: R1_4.1 OK1_2.2
N$5
  Bottom 1.016: R1_2.1 51.12,95.57 52.22,94.46 R1_3.2 Q1_1.1
N$6
  Bottom 1.016: R2_4.1 OK2_2.2
N$7  (via drill 3.2 pad 6.45)
  other vias: 69.85,95.25
N$8
  Top 0.508: R1_5.2 R1_8.1
  Top 0.813: OK1_2.3 R1_8.1
N$9
  Top 0.61: LD2.A R1_6.1
N$10
  Top 0.61: LD1.A R1_7.1
N$11
  Bottom 0.61: Q3_1.1 R3_3.2
  Bottom 1.016: R3_3.2 52.22,63.98 51.12,65.09 R3_2.1
N$12
  Top 0.813: OK3_2.3 R3_8.1 R3_5.2
N$13
  Bottom 0.61: R3_4.1 OK3_2.2
N$16
  Bottom 1.016: Q4_1.1 R4_3.2 52.22,46.2 51.12,47.31 R4_2.1
N$17
  Top 0.61: OK4_2.3 R4_5.2
  Bottom 0.61: R4_8.1 OK4_2.3
N$18
  Bottom 1.016: R4_4.1 OK4_2.2
N$21
  Bottom 1.016: R5_2.1 51.12,32.07 52.22,30.96 R5_3.2 Q5_1.1
N$22
  Top 0.61: R5_5.2 33.19,22.7 OK5_2.3
  Bottom 0.61: R5_5.2 37.77,22.71 OK5_2.3
N$23
  Bottom 1.016: R5_4.1 OK5_2.2
N$26
  Bottom 1.016: R6_2.1 51.44,16.83 52.22,16.04 R6_3.2 Q6_1.1
N$27
  Top 0.61: R6_5.2 37.76,7.47 OK6_2.3
  Bottom 0.61: R6_8.1 37.76,7.47 OK6_2.3
N$28
  Bottom 1.016: OK6_2.2 R6_4.1
N$31  (via drill 0.9)
  other vias: 76.83,102.23
N$32  (via drill 0.9)
  other vias: 76.83,-0.64
N$33  (via drill 0.9)
  other vias: -0.64,-0.64
N$34  (via drill 0.9)
  other vias: -0.64,102.23
RL_DW0
  Bottom 1.016: D4_2.C Q4_1.2 Q4_1.4 R4_4.2 | C4_2.1 D4_2.C | D4_2.C J1.2
RL_DW1
  Bottom 1.016: D5_2.C Q5_1.2 Q5_1.4 R5_4.2 | C5_2.1 D5_2.C | D5_2.C 60.64,34.61 63.5,37.47 63.5,42.55 66.84,45.88 J1.3
RL_DW2
  Bottom 0.813: Q6_1.4 Q6_1.2
  Bottom 1.016: Q6_1.2 D6_2.C | C6_2.1 D6_2.C | Q6_1.4 R6_4.2 | D6_2.C 60.33,19.37 63.82,22.86 63.82,29.21 69.85,35.24 J1.4
RL_UP0
  Bottom 1.016: D1_2.C Q1_1.2 Q1_1.4 R1_4.2 | D1_2.C 60.96,98.11 62.87,96.2 62.87,85.41 65.96,82.31 J4.2 | C1_2.1 D1_2.C
RL_UP1
  Bottom 0.813: Q2_1.4 Q2_1.2
  Bottom 1.016: R2_4.2 Q2_1.4 | C2_2.1 D2_2.C | Q2_1.2 D2_2.C | D2_2.C 60.96,82.87 65.48,78.35 J4.3
RL_UP2
  Bottom 0.813: Q3_1.2 Q3_1.4
  Bottom 1.016: Q3_1.2 D3_2.C | C3_2.1 D3_2.C | Q3_1.4 R3_4.2 | D3_2.C 60.64,67.63 67.4,74.38 J4.4
SWS_MAN_AUT
  Bottom 0.813: OK3_1.2 40.64,64.45 | 40.64,64.45 40.64,79.69 | 40.64,79.69 40.64,93.03 38.73,94.93 OK1_1.2 34.92,94.93 34.29,95.57 21.91,95.57 SV3.2 | OK2_1.2 40.64,79.69 | OK4_1.2 40.64,46.67 | 40.64,46.67 40.64,64.45 | OK5_1.2 40.64,31.43 | 40.64,31.43 40.64,46.67 | 40.64,31.43 40.64,17.78 39.05,16.19 OK6_1.2
  pour Bottom: 40.64,78.11 39.05,79.69 40.64,81.28
  pour Bottom: 40.64,62.87 39.05,64.45 40.64,66.04
  pour Bottom: 40.64,45.09 39.05,46.67 40.64,48.26
  pour Bottom: 40.64,29.53 39.05,31.43 40.64,33.02
VCC  (via drill 0.6 pad 1.93)
  Top 0.61: R1_6.2 R5_2.2
  Top 1.016: C1_1.+ OK1_2.1 | C2_1.+ 53.81,80.33 | 53.81,80.33 R2_2.2 | C1_1.+ 53.81,80.33 | C1_1.+ 53.81,93.19 56.2,95.57 R1_2.2 | C3_1.+ 53.81,65.09 | 53.81,65.09 R3_2.2 | C2_1.+ 53.81,65.09 | OK3_2.1 C3_1.+ | OK6_2.1 C6_1.+ 53.81,16.83 | C5_1.+ OK5_2.1 | 53.81,32.07 R5_2.2 | C4_1.+ 53.81,32.07 | C4_1.+ 53.81,47.31 | 53.81,47.31 R4_2.2 | C4_1.+ OK4_2.1 | 53.81,16.83 R6_2.2 | C2_1.+ OK2_2.1 | 53.81,47.31 v53.81,53.1 C3_1.+ | 53.81,32.07 C5_1.+ | C5_1.+ 53.81,16.83
  Bottom 1.016: Q2_1.3 R2_2.2 | Q1_1.3 R1_2.2 | Q3_1.3 R3_2.2 | Q5_1.3 R5_2.2 | R4_2.2 Q4_1.3 | Q6_1.3 R6_2.2
  Bottom 1.524: R6_2.2 67.63,16.83 X1.2
  pour Top: 56.2,65.09 53.66,62.55 53.66,67.63
  pour Top: 56.2,80.33 53.66,77.79 53.66,82.87
VDD  (via drill 0.9 pad 1.68)
  Top 0.813: 40.32,73.5 40.32,87.31 38.9,88.73 OK1_2.4 35.09,88.73 34.29,89.53 28.26,89.53 20.94,82.22 v20.94,69.22 v20.95,69.22 R1_7.2 20.95,53.67 C1_IC1.1 v22.86,53.66 | 40.32,73.5 OK2_2.4 | OK3_2.4 40.32,58.26 | 40.32,58.26 40.32,73.5 | 40.32,25.23 40.32,40.48 | 40.32,40.48 40.32,49.85 | 40.32,49.85 40.32,58.26 | OK5_2.4 40.32,25.23 | 40.32,25.23 40.32,21.27 39.69,20.64 39.69,10.79 38.89,9.99 OK6_2.4 34.59,9.99 C1_OK4_2.1 | OK4_2.4 40.32,40.48 | C1_OK1_2.1 40.32,49.85
  Top 1.016: C1_IC1.1 17.16,53.66 v14.3,50.8 C2_IC2.1
  Bottom 0.61: IC2.20 v14.3,50.8 | IC1.20 23.8,54.6 v22.86,53.66
  Bottom 1.016: v14.3,50.8 SV3.26 SV3.25
  pour Top: 40.32,75.08 38.73,73.49 40.32,71.91
  pour Top: 40.32,59.84 38.73,58.25 40.32,56.67
  pour Top: 40.32,42.06 38.73,40.47 40.32,38.57
  pour Top: 40.32,26.82 38.73,25.23 40.32,23.65

### Text on the board
Top: UP | +3v3 | DW | +26v | DGND | AGND